# EAGLE schematic Camera (EAGLE 9.5.2)
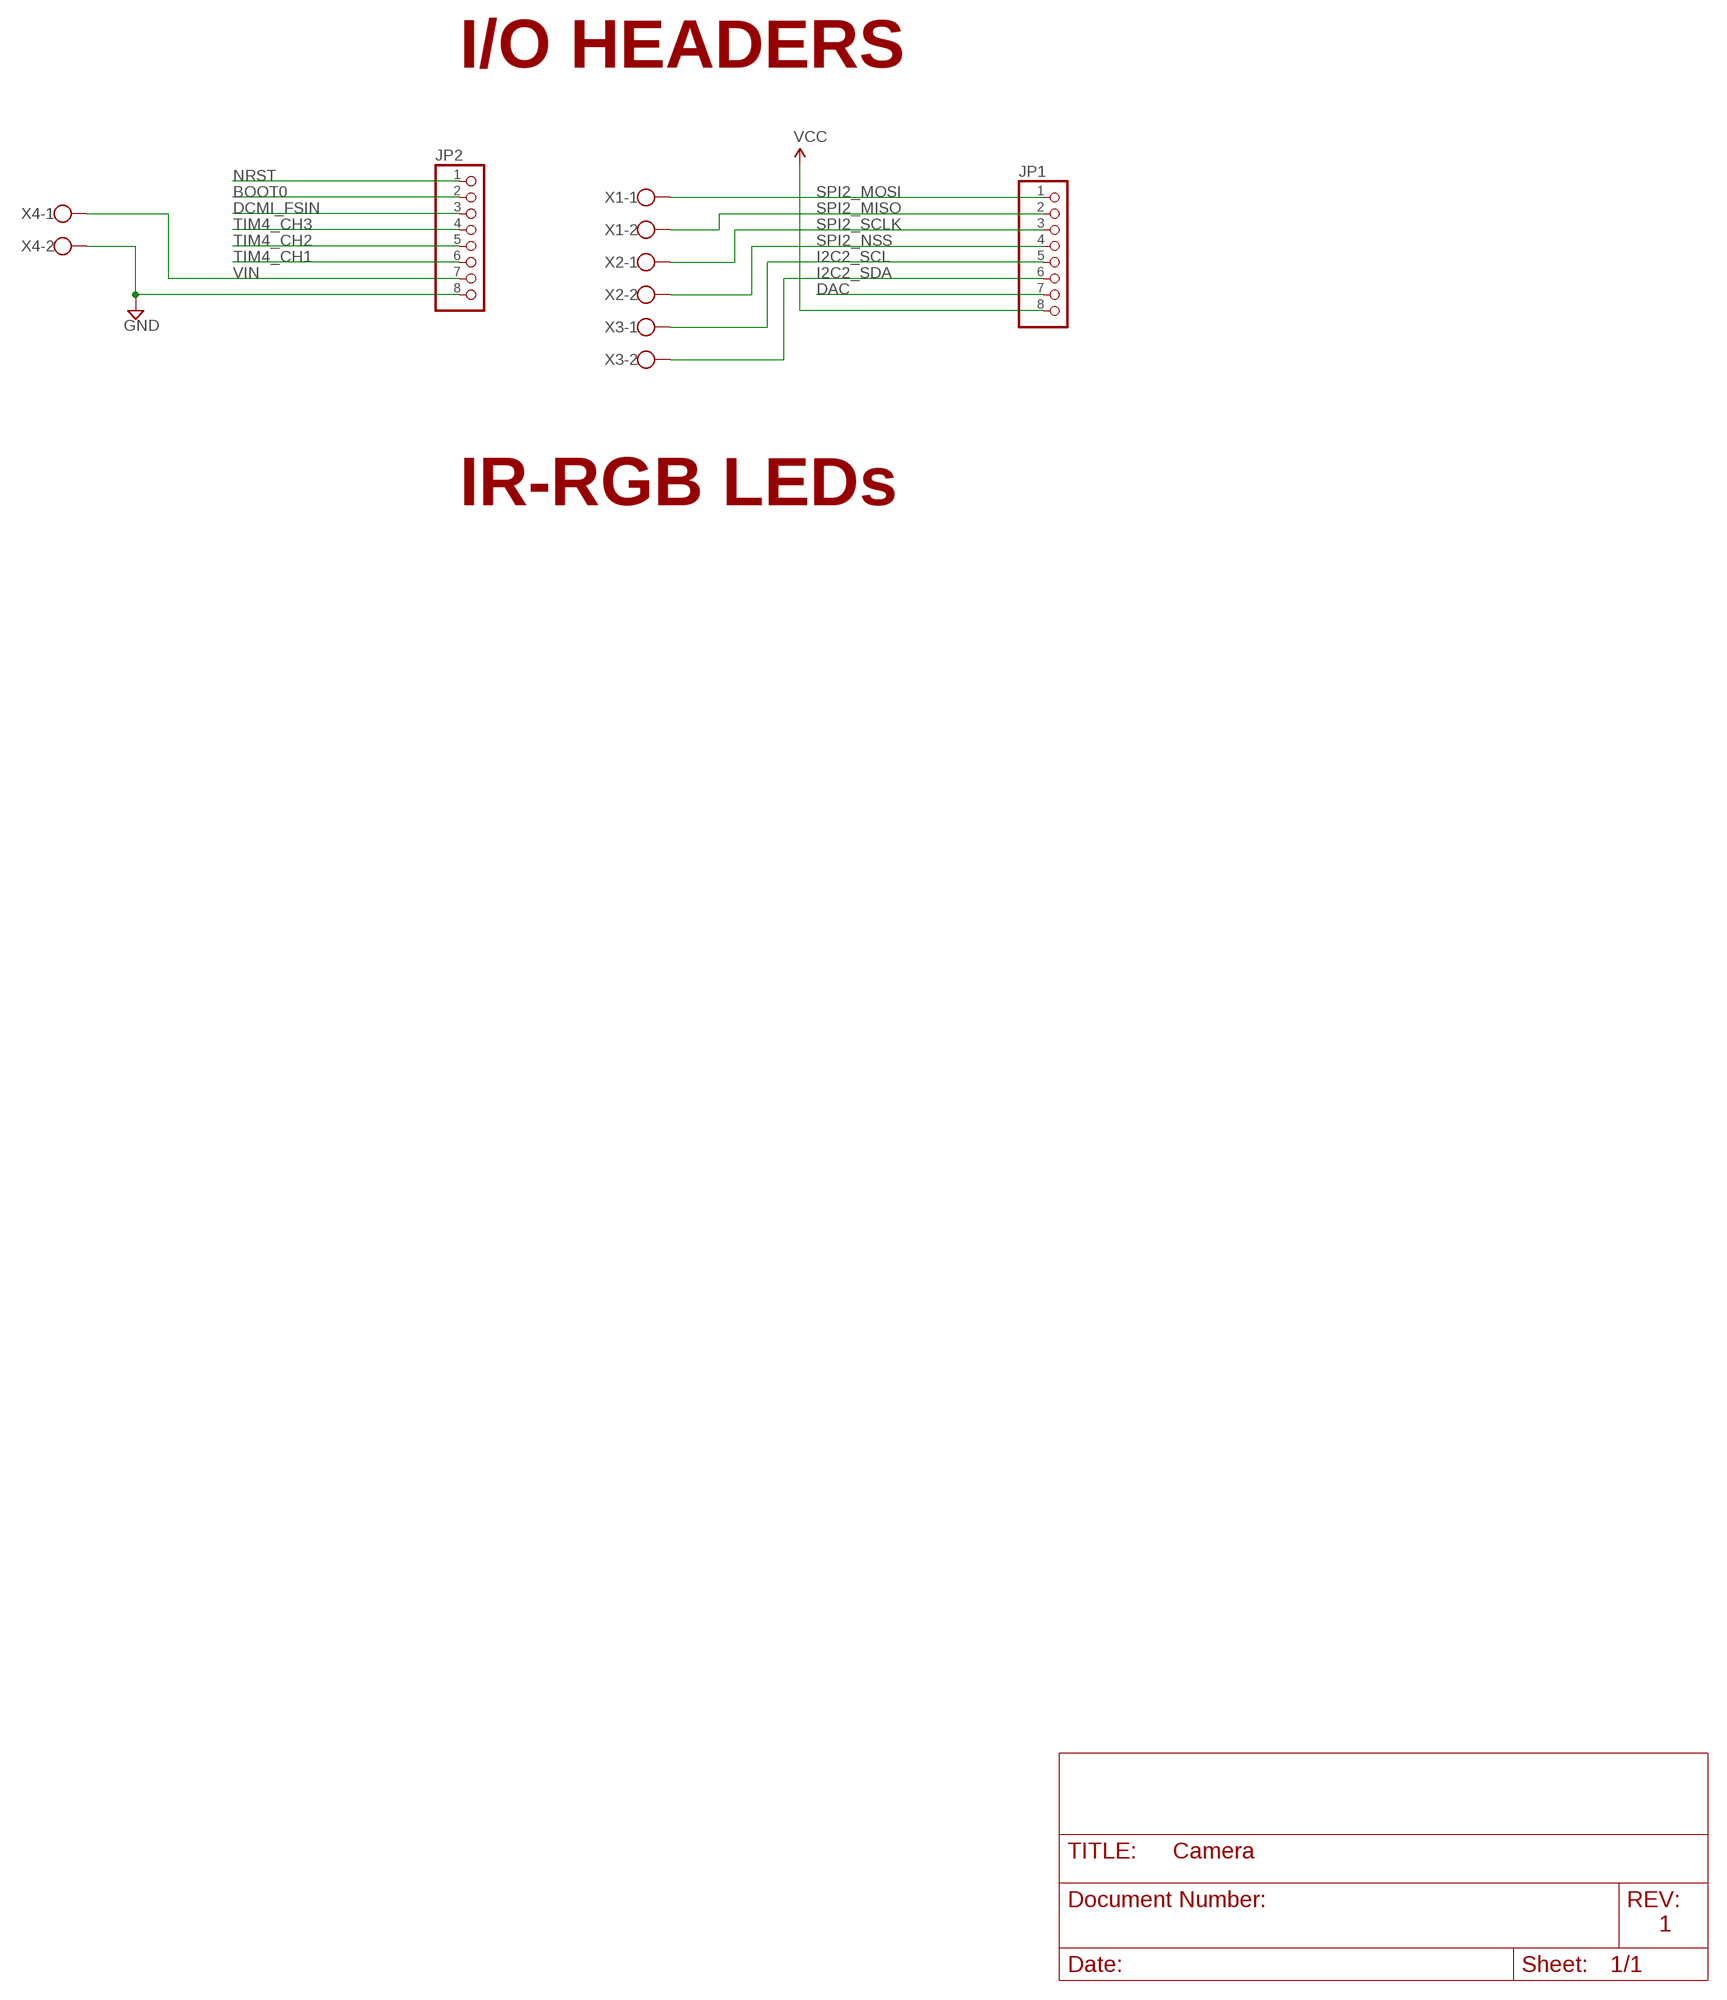
[diagram p0: schematic, sheet 1]

## Parts
JP1  PINHD-1X8  [1X08]
JP2  PINHD-1X8  [1X08]
X1  W237-102  [W237-102]
X2  W237-102  [W237-102]
X3  W237-102  [W237-102]
X4  W237-102  [W237-102]

## Nets
BOOT0: JP2.2
DAC: JP1.7
DCMI_FSIN: JP2.3
GND: JP2.8 X4.2
I2C2_SCL: JP1.5 X3.1
I2C2_SDA: JP1.6 X3.2
NRST: JP2.1
SPI2_MISO: JP1.2 X1.2
SPI2_MOSI: JP1.1 X1.1
SPI2_NSS: JP1.4 X2.2
SPI2_SCLK: JP1.3 X2.1
TIM4_CH1: JP2.6
TIM4_CH2: JP2.5
TIM4_CH3: JP2.4
VCC: JP1.8
VIN: JP2.7 X4.1

## Notes on the sheet
- I/O HEADERS
- IR-RGB LEDs
- 1

## Library data of the parts
JP1 JP2 = pinhead:PINHD-1X8: PIN HEADER
X1-X4 = con-wago-500:W237-102: WAGO SCREW CLAMP; MPN: 237-102; OC_FARNELL: unknown; OC_NEWARK: 70K9898